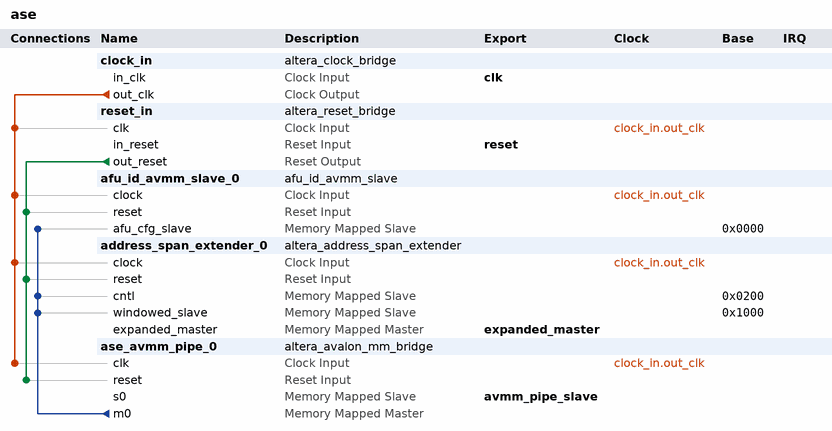
[diagram p0: system contents]
# Platform Designer (Qsys) system ase, Arria 10 10AX115N2F40E2LG
# Parameters at their usual value, and those the tool derives, are not listed.
package require -exact qsys 1.0
create_system ase
set_project_property DEVICE_FAMILY {Arria 10}
set_project_property DEVICE 10AX115N2F40E2LG

add_component clock_in ip/ase/ase_clock_in.ip altera_clock_bridge clock_in 17.1
load_component clock_in
set_component_parameter_value DERIVED_CLOCK_RATE 200000000
set_component_parameter_value EXPLICIT_CLOCK_RATE 50000000
save_component

add_component reset_in ip/ase/ase_reset_in.ip altera_reset_bridge reset_in 17.1

add_component afu_id_avmm_slave_0 ip/ase/ase_afu_id_avmm_slave_0.ip afu_id_avmm_slave afu_id_avmm_slave_0 1.0

add_component address_span_extender_0 ip/ase/ase_address_span_extender_0.ip altera_address_span_extender address_span_extender_0 17.1
load_component address_span_extender_0
set_component_parameter_value DATA_WIDTH 512
set_component_parameter_value MASTER_ADDRESS_WIDTH 48
set_component_parameter_value SLAVE_ADDRESS_WIDTH 6
set_component_parameter_value BURSTCOUNT_WIDTH 4
set_component_parameter_value MASTER_ADDRESS_DEF 0
set_component_parameter_value ENABLE_SLAVE_PORT true
set_component_parameter_value MAX_PENDING_READS 16
set_component_parameter_value SYNC_RESET 0
save_component

add_component ase_avmm_pipe_0 ip/ase/ase_mm_bridge_0.ip altera_avalon_mm_bridge ase_avmm_pipe_0 17.1

# connections
add_connection clock_in.out_clk address_span_extender_0.clock clock
add_connection clock_in.out_clk afu_id_avmm_slave_0.clock clock
add_connection clock_in.out_clk ase_avmm_pipe_0.clk clock
add_connection clock_in.out_clk reset_in.clk clock
add_connection reset_in.out_reset address_span_extender_0.reset reset
add_connection reset_in.out_reset afu_id_avmm_slave_0.reset reset
add_connection reset_in.out_reset ase_avmm_pipe_0.reset reset
add_connection ase_avmm_pipe_0.m0 address_span_extender_0.cntl avalon
set_connection_parameter_value ase_avmm_pipe_0.m0/address_span_extender_0.cntl baseAddress 0x0200
add_connection ase_avmm_pipe_0.m0 address_span_extender_0.windowed_slave avalon
set_connection_parameter_value ase_avmm_pipe_0.m0/address_span_extender_0.windowed_slave baseAddress 0x1000
add_connection ase_avmm_pipe_0.m0 afu_id_avmm_slave_0.afu_cfg_slave avalon
set_connection_parameter_value ase_avmm_pipe_0.m0/afu_id_avmm_slave_0.afu_cfg_slave baseAddress 0x0000

# exported interfaces
add_interface avmm_pipe_slave avalon slave
set_interface_property avmm_pipe_slave EXPORT_OF ase_avmm_pipe_0.s0
add_interface clk clock sink
set_interface_property clk EXPORT_OF clock_in.in_clk
add_interface expanded_master avalon master
set_interface_property expanded_master EXPORT_OF address_span_extender_0.expanded_master
add_interface reset reset sink
set_interface_property reset EXPORT_OF reset_in.in_reset

set_interconnect_requirement {$system} qsys_mm.clockCrossingAdapter HANDSHAKE
set_interconnect_requirement {$system} qsys_mm.enableEccProtection FALSE
set_interconnect_requirement {$system} qsys_mm.insertDefaultSlave FALSE
set_interconnect_requirement {$system} qsys_mm.maxAdditionalLatency 1

save_system ase.qsys
